# EAGLE schematic power5V12V (EAGLE 9.6.2)
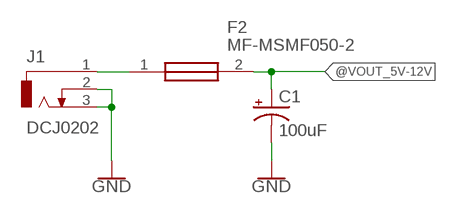
[diagram p0: schematic, sheet 1]

## Parts
C1  100uF  100UF-POLAR-EIA7343-10V-10%(TANT)  [EIA7343]
F2  MF-MSMF050-2  [FUSC4632X85N]
J1  DCJ0202  [DCJ0202]

## Nets
@VOUT_5V-12V: C1.A(+) F2.2
GND: C1.C(-) J1.2 J1.3
N$1: F2.1 J1.1

## Library data of the parts
C1 = SparkFun-Capacitors:100UF-POLAR: 100µF polarized capacitors A capacitor is a passive two-terminal electrical component used to store electrical energy temporarily in an electric field.; PROD_ID: CAP-07890
F2 = MF-MSMF050-2:MF-MSMF050-2: Fuse, PTC, Resettable, SMD, 1812, 500mA Bourns 0.5A Surface Mount Resettable Fuse, 15 V Source: Datasheet <https://www.bourns.com/pdfs/mfmsmf.pdf>; ARROW_PART_NUMBER: MF-MSMF050-2; ARROW_PRICE-STOCK: https://www.arrow.com/en/products/mf-msmf050-2/bourns?region=nac; DESCRIPTION: Fuse, PTC, Resettable, SMD, 1812, 500mA Bourns 0.5A Surface Mount Resettable Fuse, 15 V; HEIGHT: 0.85mm; MANUFACTURER_NAME: Bourns; MANUFACTURER_PART_NUMBER: MF-MSMF050-2; MOUSER_PART_NUMBER: 652-MF-MSMF050-2; MOUSER_PRICE-STOCK: https://www.mouser.co.uk/ProductDetail/Bourns/MF-MSMF050-2?qs=t3shhpq1i1DZ7OBD5kLNoA%3D%3D
J1 = con-jack:DCJ0202: DC POWER JACK Source: DCJ0202.pdf; OC_FARNELL: unknown; OC_NEWARK: unknown